# Altium schematic sheet HPFREF1.SCHDOC
size B
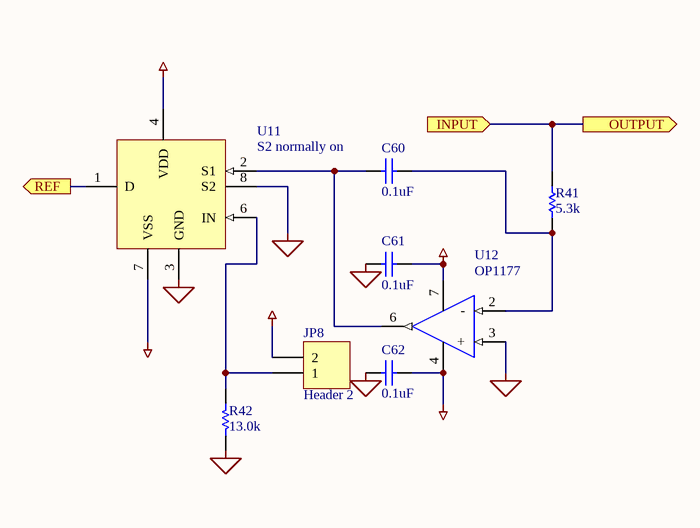
[diagram p0: HPFREF1.SCHDOC]

## Parts
C60  value 0.1uF  [CC3216-1206]  (hidden comment: Cap)
C61  value 0.1uF  [CC1608-0603]  (hidden comment: Cap)
C62  value 0.1uF  [CC1608-0603]  (hidden comment: Cap)
JP8  Header 2  [HDR1X2]
R41  value 5.3k  [CC2012-0805]  (hidden comment: Res1)
R42  value 13.0k  [CC2012-0805]  (hidden comment: Res1)
U11  S2 normally on  [MSOP8]
U12  OP1177  [SO-G8/X.6]

## Ports
INPUT (in), OUTPUT (out), REF (out)

## Nets
AGND: C61.1 C62.1 R42.1 U11.3(GND) U11.8(S2) U12.3(+)
AVDD: C61.2 JP8.2 U11.4(VDD) U12.7(+Vs)
AVSS: C62.2 U11.7(VSS) U12.4(-Vs)
INPUT: R41.1 ; port INPUT, port OUTPUT
REF: U11.1(D) ; port REF
NetC60_1: C60.1 R41.2 U12.2(-)
NetC60_2: C60.2 U11.2(S1) U12.6(Out)
NetJP8_1: JP8.1 R42.2 U11.6(IN)

## Library data of the parts
C60-C62 = Cap: Capacitor; Manufacturer: Generic Components; Class I: Passive; Published: 8-Jun-2000; Revision: July-2002: Re-released for DXP Platform.; Publisher: Altium Limited; Class II: Capacitor
JP8 = Header 2: Header, 2-Pin; Manufacturer: Generic Components; Class I: Connector; Revision: July-2002: Re-released for DXP Platform.; Publisher: Altium Limited
R41 R42 = Res1: Resistor; Manufacturer: Generic Components; Class I: Passive; Published: 8-Jun-2000; Revision: July-2002: Re-released for DXP Platform.; Publisher: Altium Limited; Class II: Resistor
U11 = ADG619: Low RON SPDT Switch
U12 = OP1177: AD Precision Low Noise, Low Input Bias Current Operational Amplifier